# EAGLE design vending-machine-i2c-adapter-r2 (EAGLE 5.12)
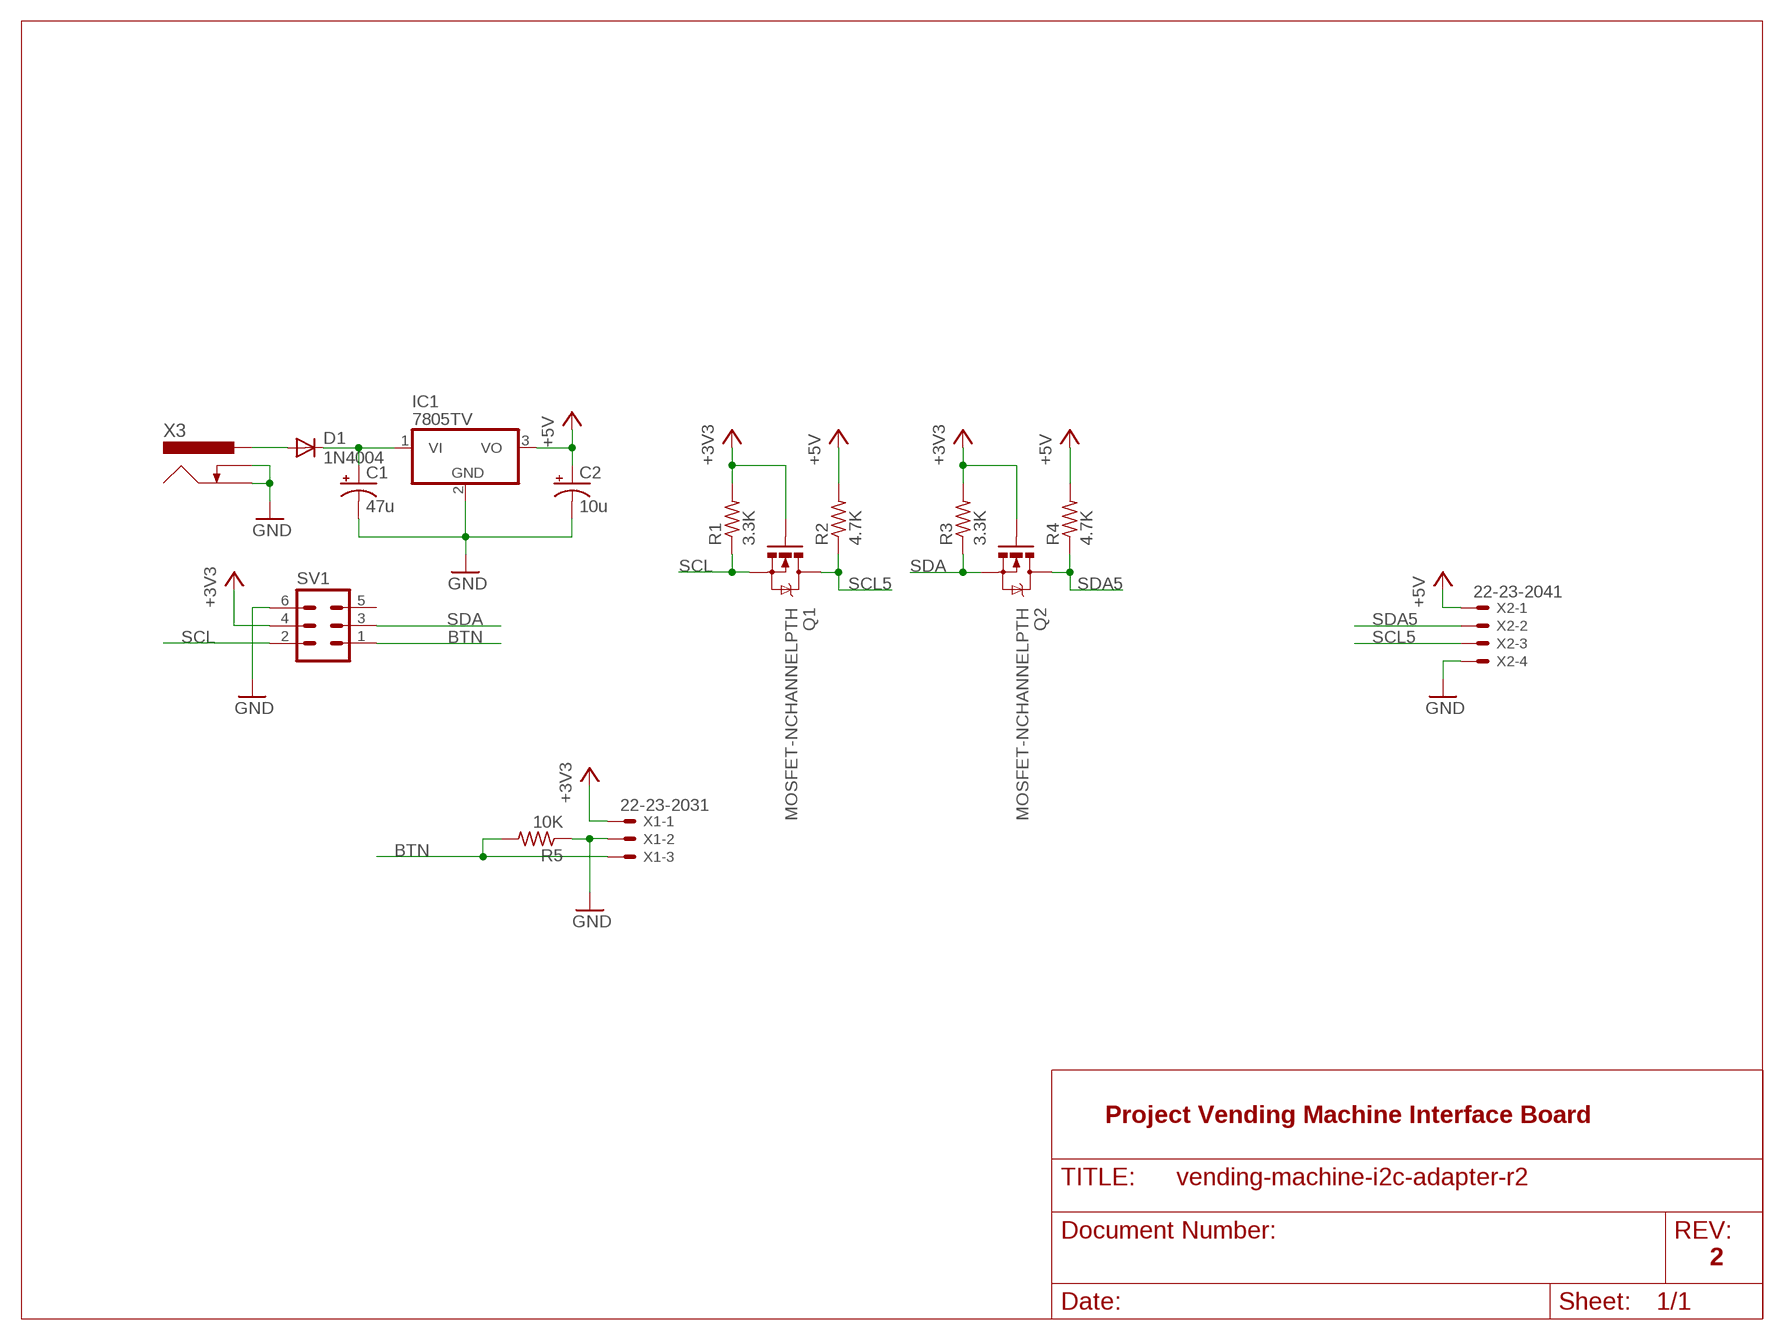
[diagram p0: schematic, sheet 1]

## Parts
C1  47u  CPOL-USE2.5-6  [E2,5-6]
C2  10u  CPOL-USE2.5-6  [E2,5-6]
D1  1N4004  [DO41-10]
IC1  7805TV  [TO220V]
Q1  MOSFET-NCHANNELPTH  [TO-92]
Q2  MOSFET-NCHANNELPTH  [TO-92]
R1  3.3K  R-US_0207/2V  [0207/2V]
R2  4.7K  R-US_0207/2V  [0207/2V]
R3  3.3K  R-US_0207/2V  [0207/2V]
R4  4.7K  R-US_0207/2V  [0207/2V]
R5  10K  R-US_0207/10  [0207/10]
SV1  ML6  [ML6]
X1  22-23-2031  [22-23-2031]
X2  22-23-2041  [22-23-2041]
X3  PJ-002A  [PJ-002]

## Nets
+3V3: Q1.3(G) Q2.3(G) R1.2 R3.2 SV1.4 X1.1
+5V: C2.+ IC1.3(VO) R2.2 R4.2 X2.1
BTN: R5.2 SV1.1 X1.3
GND: C1.- C2.- IC1.2(GND) R5.1 SV1.6 X1.2 X2.4 X3.2 X3.3
N$1: D1.A X3.1
N$2: C1.+ D1.C IC1.1(VI)
SCL: Q1.2(S) R1.1 SV1.2
SCL5: Q1.1(D) R2.1 X2.3
SDA: Q2.2(S) R3.1 SV1.3
SDA5: Q2.1(D) R4.1 X2.2
Unconnected: SV1.5

## Notes on the sheet
- Project Vending Machine Interface Board
- 2

## Library data of the parts
C1 C2 = rcl:CPOL-US: POLARIZED CAPACITOR, American symbol
D1 = diode:1N4004: DIODE general purpose rectifier, 1 A
IC1 = linear:78*: Positive VOLTAGE REGULATOR Source: http://cache.national.com/ds/LM/LM78L05.pdf http://www.fairchildsemi.com/ds/LM/LM7805.pdf
Q1 Q2 = SparkFun:MOSFET-NCHANNEL
R1-R5 = rcl:R-US_: RESISTOR, American symbol
SV1 = con-harting-ml:ML6: HARTING; OC_FARNELL: unknown; OC_NEWARK: unknown
X1 = con-molex:22-23-2031: .100" (2.54mm) Center Header - 3 Pin; MF: MOLEX; MPN: 22-23-2031; OC_FARNELL: 1462950; OC_NEWARK: 30C0862
X2 = con-molex:22-23-2041: .100" (2.54mm) Center Header - 4 Pin; MF: MOLEX; MPN: 22-23-2041; OC_FARNELL: 1462920; OC_NEWARK: 38C0355
X3 = rbg-cui-dcpower:PJ-002

## Board
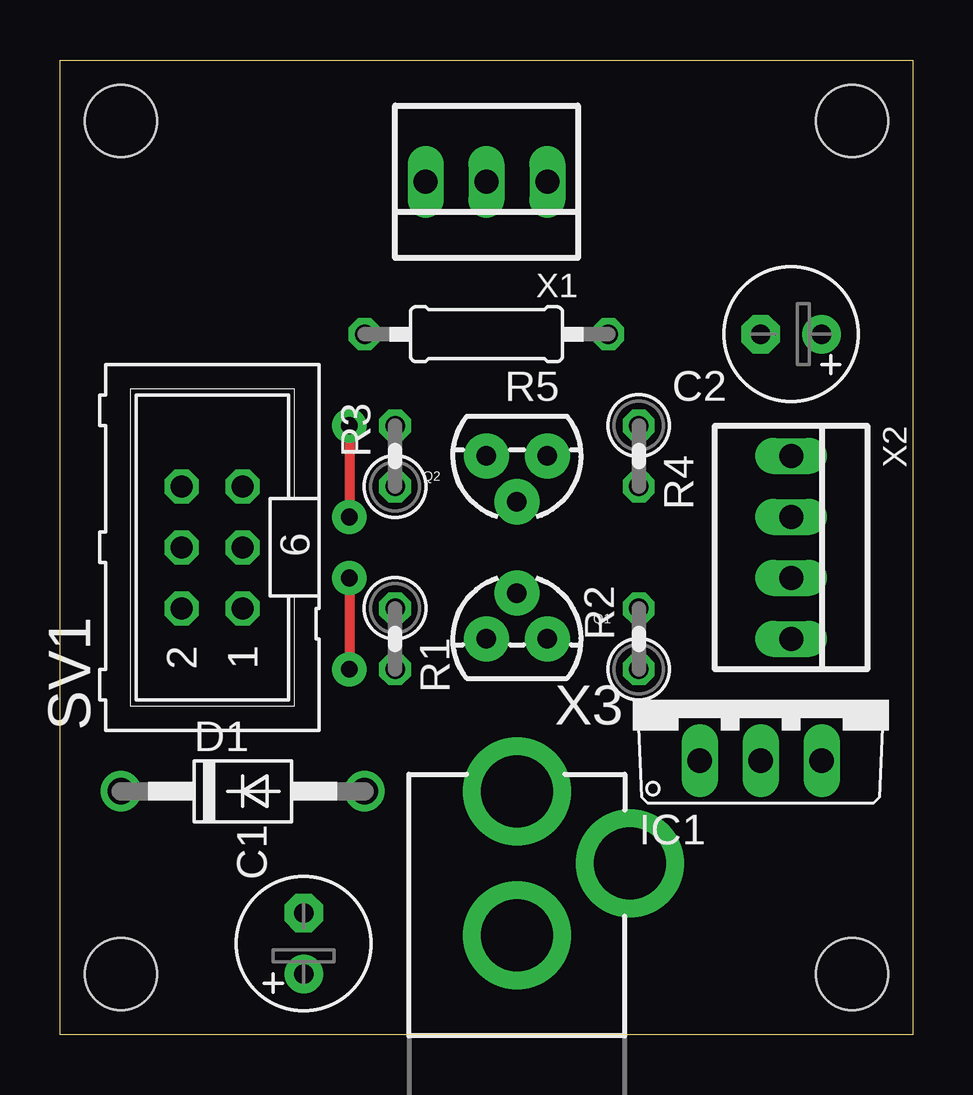
[diagram p1: board, top side]
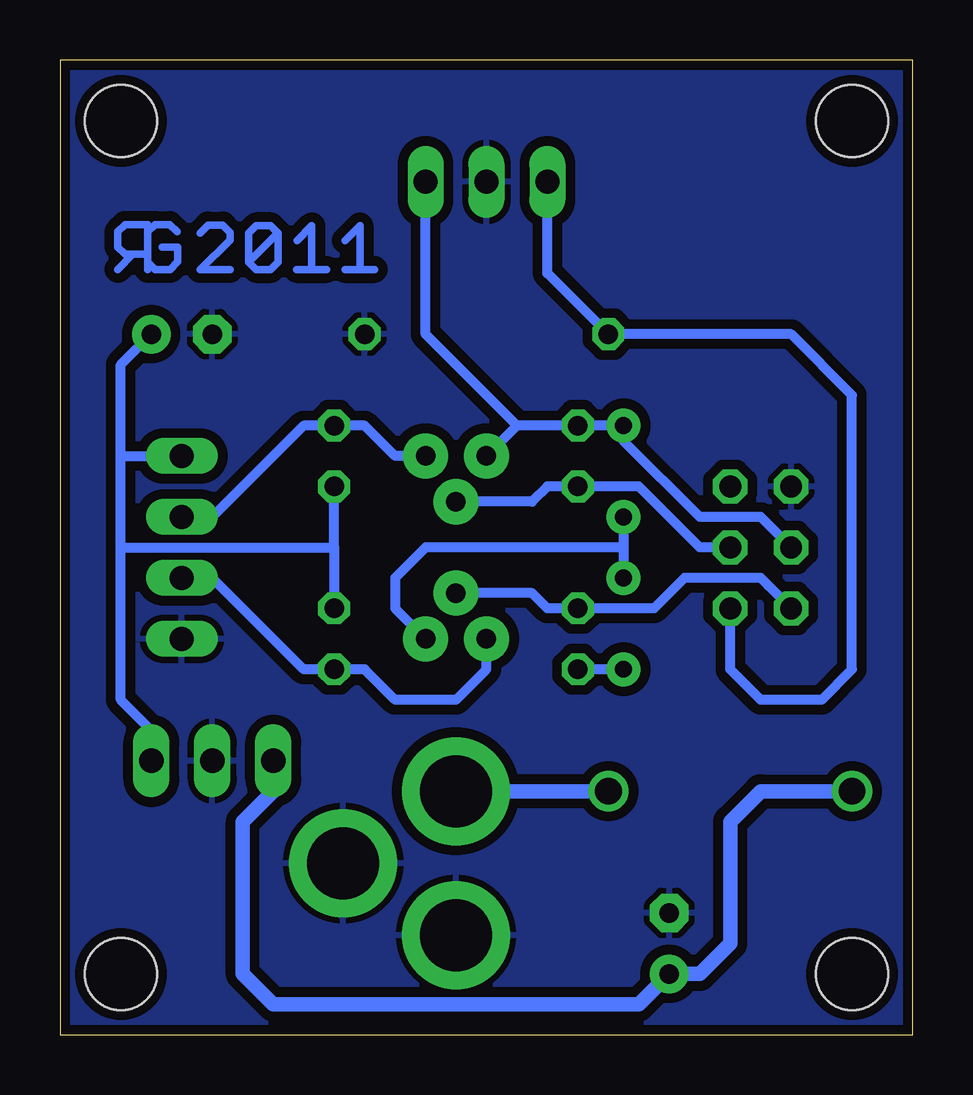
[diagram p2: board, bottom side, seen from below]

Size 35.56 x 40.64 mm. Coordinates in mm from the lower left corner, seen from the top.
Outline: 0,0 0,40.64 35.56,40.64 35.56,0 0,0
Copper layers (1*16): Top 0.035mm / dielectric 1.5mm / Bottom 0.035mm
Design rules "default *": minimum track width 10mil, minimum drill 24mil, track to track 8mil, track to pad 8mil, pad to pad 8mil, via to via 8mil, smd to smd 8mil, copper to edge 10mil, drill to drill 8mil, minimum pad ring 10mil, minimum via ring 8mil, stop-mask expansion 4mil, vias tented up to drill 0mil, thermal gap 10mil
Holes 3 mm at 2.54,38.1 33.02,38.1 2.54,2.54 33.02,2.54

### Footprints (pad centres in the part's own frame; a part is rotated, then mirrored left to right if it is on the bottom)
E2,5-6 = drill 0.813 pad 1.6 round: + -1.27,0 | drill 0.813 pad 1.6 octagon: - 1.27,0
DO41-10 = drill 1.118 round: A 5.08,0; C -5.08,0
TO220V = drill 1.016 long: 1 -2.54,-2.54; 2 0,-2.54; 3 2.54,-2.54
TO-92 = drill 0.813 pad 1.88 round: 1 -1.27,0; 2 0,1.905; 3 1.27,0
0207/2V = drill 0.813 octagon: 1 -1.27,0; 2 1.27,0
0207/10 = drill 0.813 octagon: 1 -5.08,0; 2 5.08,0
ML6 = drill 0.914 octagon: 1 -2.54,-1.27; 2 -2.54,1.27; 3 0,-1.27; 4 0,1.27; 5 2.54,-1.27; 6 2.54,1.27
22-23-2031 = drill 1 long: 1 -2.54,0; 2 0,0; 3 2.54,0
22-23-2041 = drill 1 long: 1 -3.81,0; 2 -1.27,0; 3 1.27,0; 4 3.81,0
PJ-002 = drill 3 pad 4.5 round: 1 0,0; 2 0,6; 3 -4.7,3

### Placement (x,y rotation side)
C1  10.16,3.81 90 top
C2  30.48,29.21 180 top
D1  7.62,10.16 0 top
IC1  29.21,13.97 0 top
Q1  19.05,16.51 0 top
Q2  19.05,24.13 180 top
R1  13.97,16.51 270 top
R2  24.13,16.51 90 top
R3  13.97,24.13 90 top
R4  24.13,24.13 270 top
R5  17.78,29.21 180 top
SV1  6.35,20.32 90 top
U$1  [RGLOGO_SMALL_2011]  31.75,31.75 0 bottom
X1  17.78,35.56 180 top
X2  30.48,20.32 270 top
X3  19.05,10.16 180 top

### Tracks (layer width: path | path; a pad name or v marks a point on that pad's centre or on a via)
+3V3  (via drill 0.7 pad 1.42)
  Top 0.406: v12.06,19.05 v12.06,15.24 | v12.06,25.4 v12.06,21.59
  Bottom 0.406: X1.1 20.32,29.21 16.51,25.4 | SV1.4 6.35,21.59 8.89,21.59 12.06,24.77 v12.06,25.4 R3.2 16.51,25.4 | 16.51,25.4 Q2.3 | v12.06,15.24 R1.2 | v12.06,21.59 12.06,20.32 | 12.06,20.32 v12.06,19.05 | Q1.3 21.59,17.78 21.59,19.05 20.32,20.32 12.06,20.32
+5V
  Bottom 0.406: 24.13,20.32 R2.2 | 24.13,20.32 R4.2 | IC1.3 31.75,12.7 33.02,13.97 33.02,20.32 | 33.02,20.32 33.02,24.13 | 33.02,24.13 33.02,27.94 C2.+ | 33.02,24.13 X2.1 | 33.02,20.32 24.13,20.32
BTN
  Bottom 0.406: X1.3 15.24,31.75 R5.2 5.08,29.21 2.54,26.67 2.54,15.24 3.81,13.97 6.35,13.97 7.62,15.24 SV1.1
GND
  pour Bottom (isolate 0.406): 0,40.64 35.56,40.64 35.56,0 0,0
N$1
  Bottom 0.61: D1.A X3.1
N$2
  Bottom 0.61: D1.C 6.35,10.16 7.62,8.89 7.62,3.81 8.89,2.54 C1.+ 11.43,1.27 26.67,1.27 27.94,2.54 27.94,8.89 26.67,10.16 IC1.1
SCL
  Bottom 0.406: SV1.2 6.03,18.73 6.35,19.05 9.53,19.05 10.79,17.78 R1.1 15.24,17.78 15.88,18.41 Q1.2
SCL5
  Bottom 0.406: X2.3 29.21,19.05 25.4,15.24 R2.1 22.86,15.24 21.59,13.97 19.05,13.97 17.78,15.24 Q1.1
SDA
  Bottom 0.406: SV1.3 8.89,20.32 11.43,22.86 R3.1 15.24,22.86 15.88,22.23 Q2.2
SDA5
  Bottom 0.406: Q2.1 21.59,24.13 22.86,25.4 R4.1 25.4,25.4 29.21,21.59 X2.2